# EAGLE design MaTouch DevKit_Relay V1.2 (EAGLE 6.1)
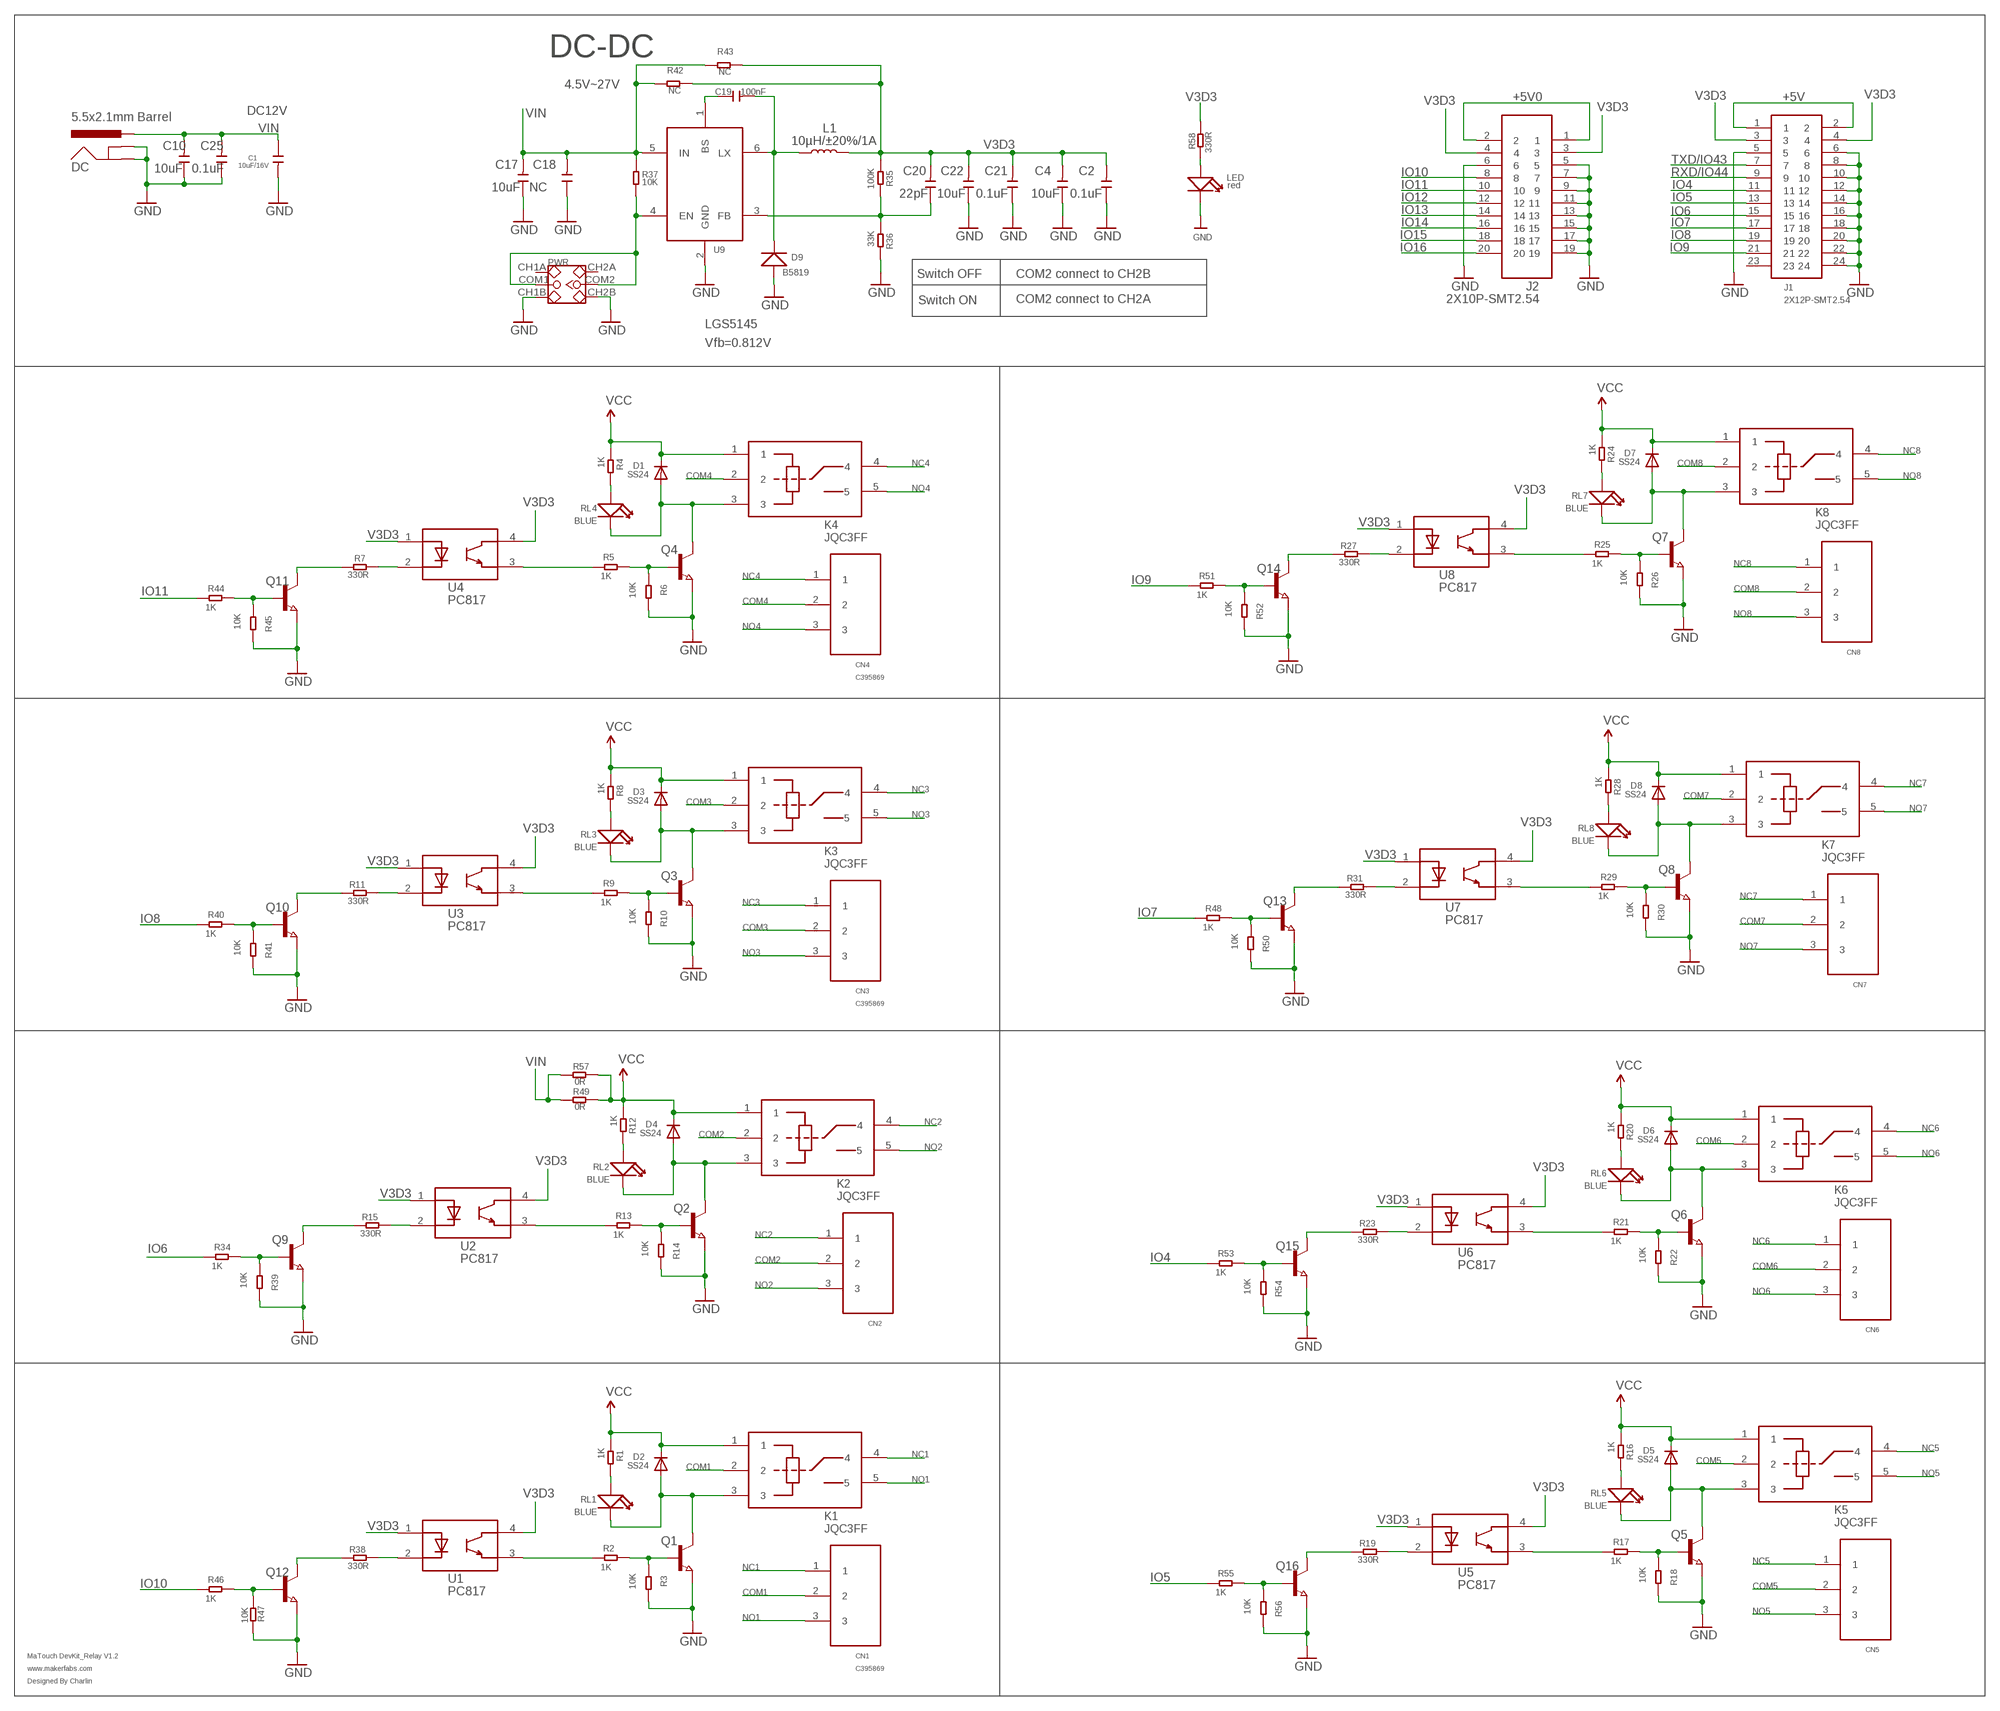
[diagram p0: schematic, sheet 1]

## Parts
C1  10uF/16V  C-0603  [0603]
C2  0.1uF  C-0603  [0603]
C4  10uF  C-0603  [0603]
C10  10uF  C-0603  [0603]
C17  10uF  C-0603  [0603]
C18  NC  C-0603  [0603]
C19  100nF  C-0603  [0603]
C20  22pF  C-0603  [0603]
C21  0.1uF  C-0603  [0603]
C22  10uF  C-0603  [0603]
C25  0.1uF  C-0603  [0603]
CN1  C395869  [PIN_3P]
CN2  C395869  [PIN_3P]
CN3  C395869  [PIN_3P]
CN4  C395869  [PIN_3P]
CN5  C395869  [PIN_3P]
CN6  C395869  [PIN_3P]
CN7  C395869  [PIN_3P]
CN8  C395869  [PIN_3P]
D1  SS24  DIODESMA  [SMADIODE]
D2  SS24  DIODESMA  [SMADIODE]
D3  SS24  DIODESMA  [SMADIODE]
D4  SS24  DIODESMA  [SMADIODE]
D5  SS24  DIODESMA  [SMADIODE]
D6  SS24  DIODESMA  [SMADIODE]
D7  SS24  DIODESMA  [SMADIODE]
D8  SS24  DIODESMA  [SMADIODE]
D9  B5819  D'1206'  [SOD123]
DC  5.5x2.1mm Barrel  POWER_JACKSMD  [POWER_JACK_SMD]
J1  2X12P-SMT2.54  [2X12P-SMT2.54]
J2  2X10P-SMT2.54  [2X10P-SMT2.54]
K1  JQC3FF  [DIP5_JQC3FF]
K2  JQC3FF  [DIP5_JQC3FF]
K3  JQC3FF  [DIP5_JQC3FF]
K4  JQC3FF  [DIP5_JQC3FF]
K5  JQC3FF  [DIP5_JQC3FF]
K6  JQC3FF  [DIP5_JQC3FF]
K7  JQC3FF  [DIP5_JQC3FF]
K8  JQC3FF  [DIP5_JQC3FF]
L1  10µH/±20%/1A  INDUCTOR-SRN6045-33UH  [SRN6045]
LED  red  DISCRETE_LED0603  [DISCRETE_LED-0603]
PWR  SWITCH-2CH-6P  [6P-2CH-2.54-7.6X3.0]
Q1  NPN-TRANSISTOR_SOT23  [SOT23]
Q2  NPN-TRANSISTOR_SOT23  [SOT23]
Q3  NPN-TRANSISTOR_SOT23  [SOT23]
Q4  NPN-TRANSISTOR_SOT23  [SOT23]
Q5  NPN-TRANSISTOR_SOT23  [SOT23]
Q6  NPN-TRANSISTOR_SOT23  [SOT23]
Q7  NPN-TRANSISTOR_SOT23  [SOT23]
Q8  NPN-TRANSISTOR_SOT23  [SOT23]
Q9  NPN-TRANSISTOR_SOT23  [SOT23]
Q10  NPN-TRANSISTOR_SOT23  [SOT23]
Q11  NPN-TRANSISTOR_SOT23  [SOT23]
Q12  NPN-TRANSISTOR_SOT23  [SOT23]
Q13  NPN-TRANSISTOR_SOT23  [SOT23]
Q14  NPN-TRANSISTOR_SOT23  [SOT23]
Q15  NPN-TRANSISTOR_SOT23  [SOT23]
Q16  NPN-TRANSISTOR_SOT23  [SOT23]
R1  1K  R-0603  [R0603]
R2  1K  R-0603  [R0603]
R3  10K  R-0603  [R0603]
R4  1K  R-0603  [R0603]
R5  1K  R-0603  [R0603]
R6  10K  R-0603  [R0603]
R7  330R  R-0603  [R0603]
R8  1K  R-0603  [R0603]
R9  1K  R-0603  [R0603]
R10  10K  R-0603  [R0603]
R11  330R  R-0603  [R0603]
R12  1K  R-0603  [R0603]
R13  1K  R-0603  [R0603]
R14  10K  R-0603  [R0603]
R15  330R  R-0603  [R0603]
R16  1K  R-0603  [R0603]
R17  1K  R-0603  [R0603]
R18  10K  R-0603  [R0603]
R19  330R  R-0603  [R0603]
R20  1K  R-0603  [R0603]
R21  1K  R-0603  [R0603]
R22  10K  R-0603  [R0603]
R23  330R  R-0603  [R0603]
R24  1K  R-0603  [R0603]
R25  1K  R-0603  [R0603]
R26  10K  R-0603  [R0603]
R27  330R  R-0603  [R0603]
R28  1K  R-0603  [R0603]
R29  1K  R-0603  [R0603]
R30  10K  R-0603  [R0603]
R31  330R  R-0603  [R0603]
R34  1K  R-0603  [R0603]
R35  100K  R-0603  [R0603]
R36  33K  R-0603  [R0603]
R37  10K  R-0603  [R0603]
R38  330R  R-0603  [R0603]
R39  10K  R-0603  [R0603]
R40  1K  R-0603  [R0603]
R41  10K  R-0603  [R0603]
R42  NC  R-0603  [R0603]
R43  NC  R-0603  [R0603]
R44  1K  R-0603  [R0603]
R45  10K  R-0603  [R0603]
R46  1K  R-0603  [R0603]
R47  10K  R-0603  [R0603]
R48  1K  R-0603  [R0603]
R49  0R  R-0603  [R0603]
R50  10K  R-0603  [R0603]
R51  1K  R-0603  [R0603]
R52  10K  R-0603  [R0603]
R53  1K  R-0603  [R0603]
R54  10K  R-0603  [R0603]
R55  1K  R-0603  [R0603]
R56  10K  R-0603  [R0603]
R57  0R  R-0603  [R0603]
R58  330R  R-0603  [R0603]
RL1  BLUE  LED'0603'  [LED-0603]
RL2  BLUE  LED'0603'  [LED-0603]
RL3  BLUE  LED'0603'  [LED-0603]
RL4  BLUE  LED'0603'  [LED-0603]
RL5  BLUE  LED'0603'  [LED-0603]
RL6  BLUE  LED'0603'  [LED-0603]
RL7  BLUE  LED'0603'  [LED-0603]
RL8  BLUE  LED'0603'  [LED-0603]
U1  PC817  [SMD4-254P-1016L460W]
U2  PC817  [SMD4-254P-1016L460W]
U3  PC817  [SMD4-254P-1016L460W]
U4  PC817  [SMD4-254P-1016L460W]
U5  PC817  [SMD4-254P-1016L460W]
U6  PC817  [SMD4-254P-1016L460W]
U7  PC817  [SMD4-254P-1016L460W]
U8  PC817  [SMD4-254P-1016L460W]
U9  SY8201ABC  [SOT-23-6]

## Nets
+5V: J1.1 J1.2
+5V0: J2.1 J2.2
COM1: CN1.2 K1.2
COM2: CN2.2 K2.2
COM3: CN3.2 K3.2
COM4: CN4.2 K4.2
COM5: CN5.2 K5.2
COM6: CN6.2 K6.2
COM7: CN7.2 K7.2
COM8: CN8.2 K8.2
GND: C1.2 C2.1 C4.1 C10.1 C17.1 C18.1 C21.1 C22.1 C25.1 D9.+ DC.GND(GNDBREAK) DC.P$4(GND) J1.5 J1.6 J1.8 J1.10 J1.12 J1.14 J1.16 J1.18 J1.20 J1.22 J1.24 J2.5 J2.6 J2.7 J2.9 J2.11 J2.13 J2.15 J2.17 J2.19 LED.- PWR.CH1B PWR.CH2B Q1.2(E) Q2.2(E) Q3.2(E) Q4.2(E) Q5.2(E) Q6.2(E) Q7.2(E) Q8.2(E) Q9.2(E) Q10.2(E) Q11.2(E) Q12.2(E) Q13.2(E) Q14.2(E) Q15.2(E) Q16.2(E) R3.2 R6.2 R10.2 R14.2 R18.2 R22.2 R26.2 R30.2 R36.2 R39.2 R41.2 R45.2 R47.2 R50.2 R52.2 R54.2 R56.2 U9.2(GND)
IO4: J1.11 R53.1
IO5: J1.13 R55.1
IO6: J1.15 R34.1
IO7: J1.17 R48.1
IO8: J1.19 R40.1
IO9: J1.21 R51.1
IO10: J2.8 R46.1
IO11: J2.10 R44.1
IO12: J2.12
IO13: J2.14
IO14: J2.16
IO15: J2.18
IO16: J2.20
N$1: R2.1 U1.3
N$2: R4.2 RL4.+
N$3: R1.2 RL1.+
N$4: D1.A K4.3 Q4.3(C) RL4.-
N$5: Q4.1(B) R5.2 R6.1
N$6: R7.2 U4.2
N$7: R5.1 U4.3
N$8: R8.2 RL3.+
N$9: D2.A K1.3 Q1.3(C) RL1.-
N$10: D3.A K3.3 Q3.3(C) RL3.-
N$11: Q3.1(B) R9.2 R10.1
N$12: R11.2 U3.2
N$13: R9.1 U3.3
N$14: Q1.1(B) R2.2 R3.1
N$15: R12.2 RL2.+
N$16: D4.A K2.3 Q2.3(C) RL2.-
N$17: Q2.1(B) R13.2 R14.1
N$18: R15.2 U2.2
N$19: R13.1 U2.3
N$20: R16.2 RL5.+
N$21: D5.A K5.3 Q5.3(C) RL5.-
N$22: Q5.1(B) R17.2 R18.1
N$23: R19.2 U5.2
N$24: R17.1 U5.3
N$25: R20.2 RL6.+
N$26: D6.A K6.3 Q6.3(C) RL6.-
N$27: Q6.1(B) R21.2 R22.1
N$28: R23.2 U6.2
N$29: R21.1 U6.3
N$30: R24.2 RL7.+
N$31: D7.A K8.3 Q7.3(C) RL7.-
N$32: Q7.1(B) R25.2 R26.1
N$33: R38.2 U1.2
N$34: R27.2 U8.2
N$35: R25.1 U8.3
N$36: R28.2 RL8.+
N$37: D8.A K7.3 Q8.3(C) RL8.-
N$38: Q8.1(B) R29.2 R30.1
N$39: R31.2 U7.2
N$40: R29.1 U7.3
N$41: C19.2 D9.- L1.1 U9.6(LX)
N$42: C19.1 U9.1(BS)
N$43: C20.1 R35.2 R36.1 U9.3(FB)
N$44: PWR.COM1 PWR.COM2 R37.2 U9.4(EN)
N$45: LED.+ R58.1
N$46: Q9.1(B) R34.2 R39.1
N$47: Q9.3(C) R15.1
N$48: Q10.1(B) R40.2 R41.1
N$49: Q10.3(C) R11.1
N$50: Q11.1(B) R44.2 R45.1
N$51: Q11.3(C) R7.1
N$52: Q12.1(B) R46.2 R47.1
N$53: Q12.3(C) R38.1
N$54: Q13.1(B) R48.2 R50.1
N$55: Q13.3(C) R31.1
N$56: Q14.1(B) R51.2 R52.1
N$57: Q14.3(C) R27.1
N$58: Q15.1(B) R53.2 R54.1
N$59: Q15.3(C) R23.1
N$60: Q16.1(B) R55.2 R56.1
N$61: Q16.3(C) R19.1
NC1: CN1.1 K1.4
NC2: CN2.1 K2.4
NC3: CN3.1 K3.4
NC4: CN4.1 K4.4
NC5: CN5.1 K5.4
NC6: CN6.1 K6.4
NC7: CN7.1 K7.4
NC8: CN8.1 K8.4
NO1: CN1.3 K1.5
NO2: CN2.3 K2.5
NO3: CN3.3 K3.5
NO4: CN4.3 K4.5
NO5: CN5.3 K5.5
NO6: CN6.3 K6.5
NO7: CN7.3 K7.5
NO8: CN8.3 K8.5
RXD/IO44: J1.9
TXD/IO43: J1.7
V3D3: C2.2 C4.2 C20.2 C21.2 C22.2 J1.3 J1.4 J2.3 J2.4 L1.2 R35.1 R42.2 R43.2 R58.2 U1.1 U1.4 U2.1 U2.4 U3.1 U3.4 U4.1 U4.4 U5.1 U5.4 U6.1 U6.4 U7.1 U7.4 U8.1 U8.4
VCC: D1.C D2.C D3.C D4.C D5.C D6.C D7.C D8.C K1.1 K2.1 K3.1 K4.1 K5.1 K6.1 K7.1 K8.1 R1.1 R4.1 R8.1 R12.1 R16.1 R20.1 R24.1 R28.1 R49.2 R57.2
VIN: C1.1 C10.2 C17.2 C18.2 C25.2 DC.VIN0(PWR) R37.1 R42.1 R43.1 R49.1 R57.1 U9.5(IN)
Unconnected: J1.23 PWR.CH1A PWR.CH2A

## Notes on the sheet
- DC-DC
- 4.5V~27V
- DC12V
- Switch OFF | COM2 connect to CH2B
- Switch ON | COM2 connect to CH2A
- LGS5145
- Vfb=0.812V
- MaTouch DevKit_Relay V1.2
- www.makerfabs.com
- Designed By Charlin

## Library data of the parts
C1 C2 C4 C10 C17-C22 C25 = Discrete:C*: Ceramic Capacitors
CN1-CN8 = 1mytest:C395869
D1-D8 = adafruit:DIODE: Diode SMADIODE - SMA Surface Mount Package 20V 1A Schottky Diode Digikey: 641-1014-6-ND DO-1N4148 - Through Hole Small Current Diode SOD-123 20V 1 A (.5mV Vf) Schottky Diode - Digikey: MBRX120TPMSCT-ND SOD-323 10V 570mA (.38mV Vf, 3ns) Schottky Diode - Digikey: ZLLS410CT-ND SOD-523 30V 30mA Schottky Diode (RB751S-40TE61) - Digikey: RB751S-40TE61CT-ND SOT23-R/W - SOT23 Package (R = Solder Paste/Reflow Ovens, W = Hand-Soldering) BAT54Film 40V 300mA - Digikey: 497-7162-1-ND
D9 = Discrete:D*
DC = SparkFun-Connectors:POWER_JACK: Power Jack Connector This is the standard 5.5mm barrel jack for power. The PTH is the most common, proven, reliable, footprint. The Slot footprint only works if the mill layer is transmitted to the PCB fab house so be warned. Here are the connectors we sell at SparkFun: DC Barrel Power Jack/Connector <https://www.sparkfun.com/products/119> (PRT-00119) DC Barrel Power Jack/Connector (SMD) <https://www.sparkfun.com/products/12748> (PRT-12748) DC Barrel Jack Adapter - Breadboard Compatible <https://www.sparkfun.com/products/10811> (PRT-10811) It is used on this SparkFun product (and many, many others): SparkFun RedBoard - Programmed with Arduino <https://www.sparkfun.com/products/12757> (DEV-12757) Also, if you need a mating power supply or connector, please check these out: Wall Adapter Power Supply - 9VDC 650mA <https://www.sparkfun.com/products/298> (TOL-00298) DC Barrel Jack Adapter - Male <https://www.sparkfun.com/products/10287> (PRT-10287); PROD_ID: CONN-08106; SF_ID: PRT-12748
J1 = sale:2X12P-SMT2.54
J2 = sale:2X10P-SMT2.54
K1-K8 = 1mytest:JQC3FF
L1 = SparkFun-Coils:INDUCTOR: Inductors Resist changes in electrical current. Basically a coil of wire. SparkFun Products: SparkFun Load Cell Amplifier - HX711 <https://www.sparkfun.com/products/13879> IOIO-OTG - V2.2 <https://www.sparkfun.com/products/13613>; PROD_ID: NDUC-11627; VALUE: 33µH/±20%/1.4A
LED = A9G:DISCRETE_LED*
PWR = Discrete:SWITCH-2CH-6P
Q1-Q16 = semicon-smd-ipc:NPN-TRANSISTOR_: NPN TRANSISTOR
R1-R31 R34-R58 = Discrete:R*
RL1-RL8 = Discrete:LED*
U1-U8 = self:PC817
U9 = self:SY8201ABC

## Net classes
0 default: width 0.203 mm, drill 0.305 mm, clearance 0.152 mm

## Board
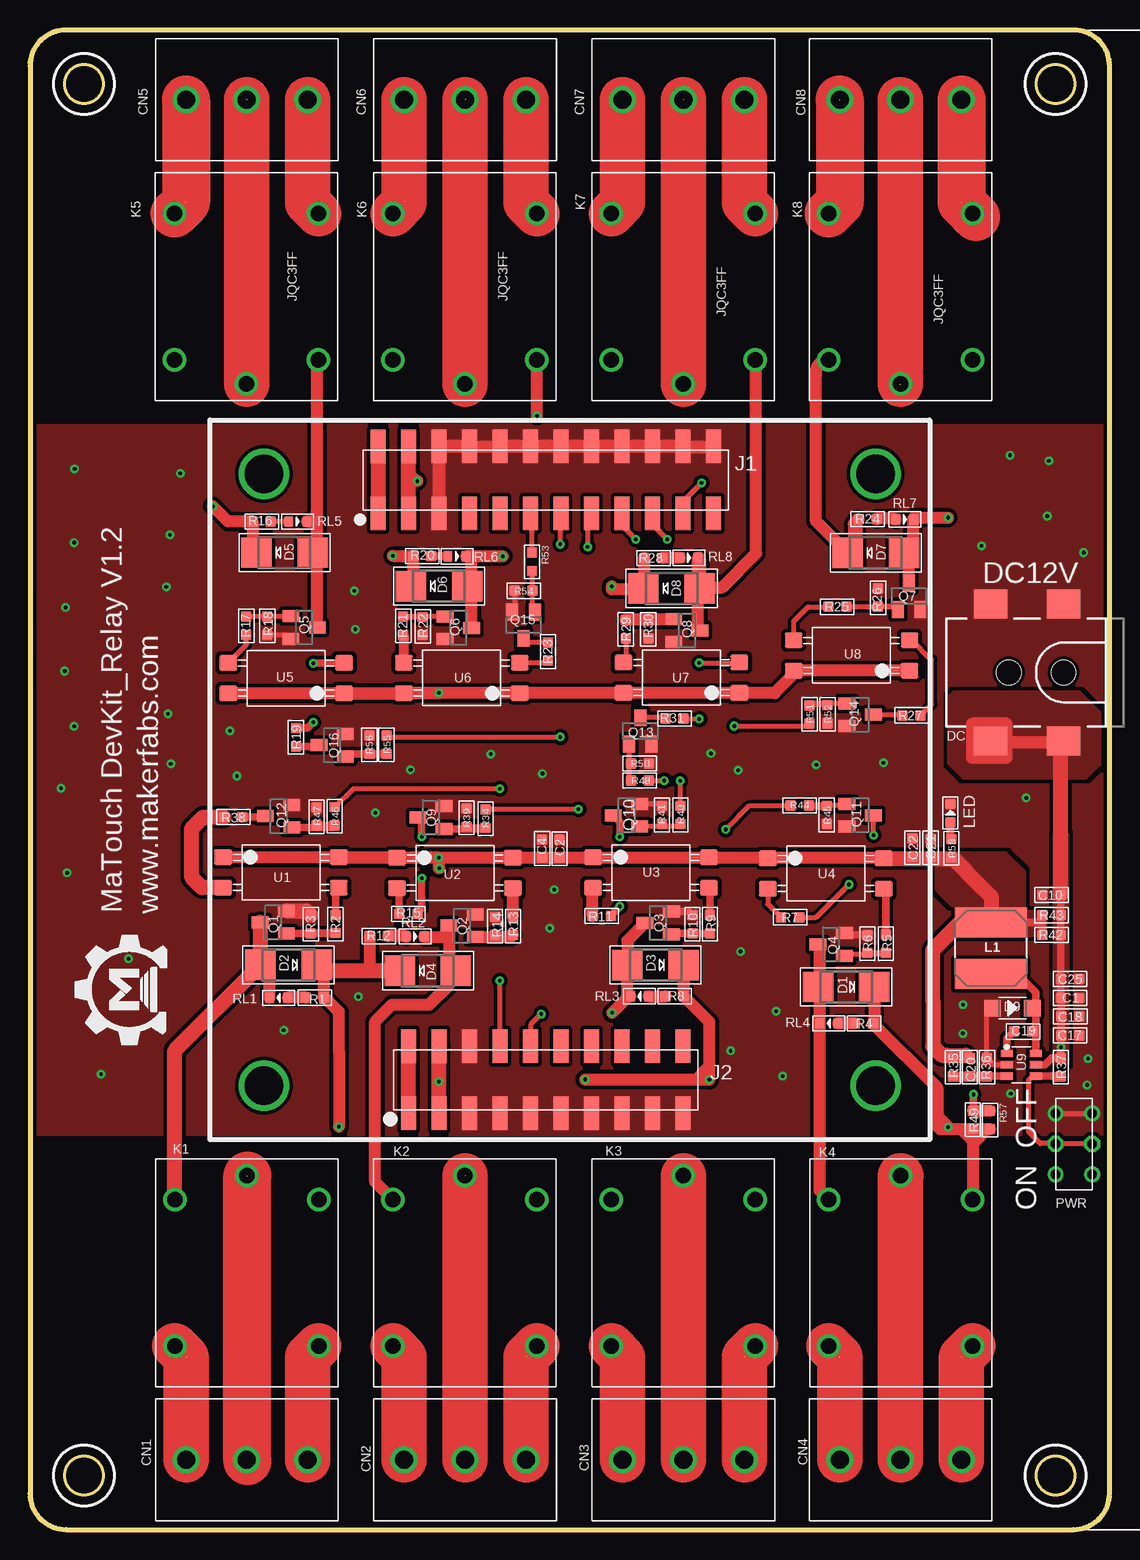
[diagram p1: board, top side]
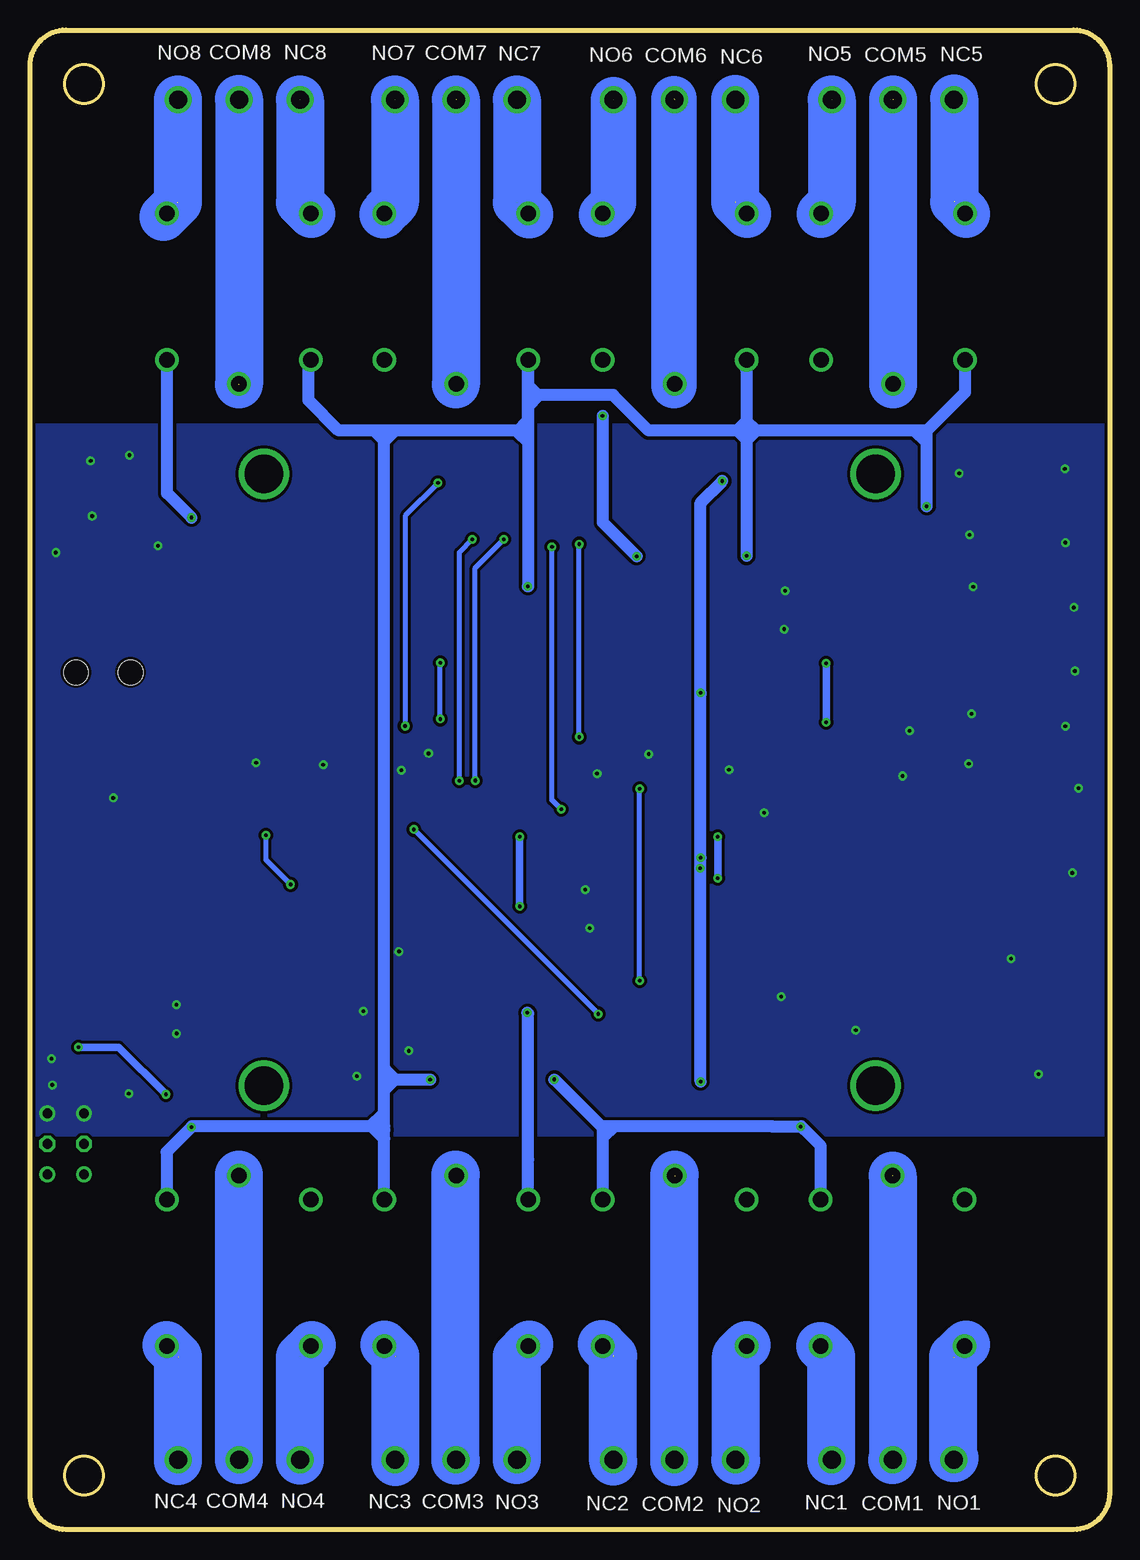
[diagram p2: board, bottom side, seen from below]

Size 90 x 125 mm. Coordinates in mm from the lower left corner, seen from the top.
Outline: 87,125 3,125 arc90 0,122 0,3 arc90 3,0 87,0 arc90 90,3 90,122 arc90 87,125
Outline: circle at 85.5,120.5 radius 1.6
Outline: circle at 85.5,4.5 radius 1.6
Outline: circle at 4.5,4.5 radius 1.6
Outline: circle at 4.5,120.5 radius 1.6
Copper layers (1*16): Top 0.035mm / dielectric 1.5mm / Bottom 0.035mm
Design rules: minimum track width 10mil, minimum drill 10mil, track to track 8mil, track to pad 8mil, pad to pad 8mil, via to via 8mil, smd to smd 0mil, copper to edge 10mil, drill to drill 8mil, minimum pad ring 10mil, minimum via ring 8mil, stop-mask expansion 4mil, vias tented up to drill 30mil, thermal gap 0mil

### Footprints (pad centres in the part's own frame; a part is rotated, then mirrored left to right if it is on the bottom)
0603 = smd 0.889 x 0.889: 1 -0.762,0; 2 0.762,0
PIN_3P = drill 1.5: 1 0,10.16; 2 0,5.08; 3 0,0
SMADIODE = smd 2.54 x 2.54: A 2.349,0; C -2.349,0
SOD123 = smd 1.397 x 1.397: + -1.651,0; - 1.651,0
POWER_JACK_SMD = smd 2.8 x 2.4: GND 0,-5.7; P$4 6.1,-5.7; VIN0 0,5.7; VIN1 6.1,5.7 | hole 2.032: 0,0; 4.572,0
2X12P-SMT2.54 = smd 1.27 x 2.8: 1 -13.97,-2.8; 2 -13.97,2.8; 3 -11.43,-2.8; 4 -11.43,2.8; 5 -8.89,-2.8; 6 -8.89,2.8; 7 -6.35,-2.8; 8 -6.35,2.8; 9 -3.81,-2.8; 10 -3.81,2.8; 11 -1.27,-2.8; 12 -1.27,2.8; 13 1.27,-2.8; 14 1.27,2.8; 15 3.81,-2.8; 16 3.81,2.8; 17 6.35,-2.8; 18 6.35,2.8; 19 8.89,-2.8; 20 8.89,2.8; 21 11.43,-2.8; 22 11.43,2.8; 23 13.97,-2.8; 24 13.97,2.8
2X10P-SMT2.54 = smd 1.27 x 2.8: 1 -11.43,-2.8; 2 -11.43,2.8; 3 -8.89,-2.8; 4 -8.89,2.8; 5 -6.35,-2.8; 6 -6.35,2.8; 7 -3.81,-2.8; 8 -3.81,2.8; 9 -1.27,-2.8; 10 -1.27,2.8; 11 1.27,-2.8; 12 1.27,2.8; 13 3.81,-2.8; 14 3.81,2.8; 15 6.35,-2.8; 16 6.35,2.8; 17 8.89,-2.8; 18 8.89,2.8; 19 11.43,-2.8; 20 11.43,2.8
DIP5_JQC3FF = drill 1.3: 1 0,12; 2 -2,6; 3 0,0; 4 12.2,12; 5 12.2,0
SRN6045 = smd 2.5 x 6: 1 -2.175,0; 2 2.125,0
DISCRETE_LED-0603 = smd 0.889 x 0.889: + -0.762,0; - 0.762,0
6P-2CH-2.54-7.6X3.0 = drill 0.813 pad 1.27: CH1A -1.524,2.54; CH1B -1.524,-2.54; CH2A 1.524,2.54; CH2B 1.524,-2.54 | drill 0.813 pad 1.27 octagon: COM1 -1.524,0; COM2 1.524,0
SOT23 = smd 1 x 1.4: 1 -0.95,-1.1; 2 0.95,-1.1; 3 0,1.1
R0603 = smd 0.889 x 0.889: 1 -0.762,0; 2 0.762,0
LED-0603 = smd 0.762 x 0.889: + -0.762,0; - 0.762,0
SMD4-254P-1016L460W = smd 1.5 x 1.3: 1 -4.83,1.27; 2 -4.83,-1.27; 3 4.83,-1.27; 4 4.83,1.27
SOT-23-6 = smd 1 x 0.6: 1 -1.2,0.95; 2 -1.2,0; 3 -1.2,-0.95; 4 1.2,-0.95; 5 1.2,0; 6 1.2,0.95

### Placement (x,y rotation side)
C1  86.72,44.32 0 top
C2  44.15,56.77 270 top
C4  42.7,56.77 270 top
C10  85.17,52.89 0 top
C17  86.72,41.19 180 top
C18  86.73,42.77 180 top
C19  82.79,41.51 0 top
C20  78.35,38.54 90 top
C21  75.09,56.82 270 top
C22  73.57,56.83 270 top
C25  86.72,45.89 180 top
CN1  13,5.8 270 top
CN2  31.2,5.8 270 top
CN3  49.4,5.8 270 top
CN4  67.5,5.8 270 top
CN5  23.16,119.2 90 top
CN6  41.36,119.2 90 top
CN7  59.56,119.2 90 top
CN8  77.66,119.2 90 top
D1  68.04,45.23 180 top
D2  21.56,47.07 180 top
D3  52.16,47.06 180 top
D4  33.17,46.58 0 top
D5  21.22,81.44 0 top
D6  34.1,78.64 0 top
D7  70.51,81.42 0 top
D8  53.49,78.45 0 top
D9  81.9,43.46 0 top
DC  86.18,71.44 180 top
J1  43,87.5 0 top
J2  43,37.5 0 top
K1  12.07,27.5 270 top
K2  30.25,27.5 270 top
K3  48.47,27.5 270 top
K4  66.6,27.5 270 top
K5  24.05,97.5 90 top
K6  42.25,97.5 90 top
K7  60.47,97.5 90 top
K8  78.57,97.5 90 top
L1  80.11,48.49 90 top
LED  76.73,59.72 90 top
PWR  87.03,32.14 180 top
Q1  20.28,50.62 90 top
Q2  36.02,50.33 90 top
Q3  52.37,50.55 90 top
Q4  66.79,48.78 90 top
Q5  22.86,75.2 270 top
Q6  35.71,75.16 270 top
Q7  73.29,77.8 0 top
Q8  54.76,74.93 270 top
Q9  33.43,59.36 90 top
Q10  49.73,59.54 90 top
Q11  69.22,59.54 270 top
Q12  20.73,59.46 90 top
Q13  50.88,66.57 0 top
Q14  69.22,67.92 270 top
Q15  41.15,75.39 180 top
Q16  25.2,65.38 90 top
R1  23.75,44.34 180 top
R2  25.46,50.47 270 top
R3  23.41,50.46 90 top
R4  69.53,42.19 180 top
R5  71.34,48.84 270 top
R6  69.8,48.82 90 top
R7  63.39,51.03 180 top
R8  53.75,44.45 180 top
R9  56.69,50.45 270 top
R10  55.23,50.45 90 top
R11  47.68,51.14 180 top
R12  29.09,49.46 0 top
R13  40.26,50.31 270 top
R14  38.78,50.31 90 top
R15  31.54,51.3 180 top
R16  19.32,84.02 0 top
R17  18.04,75.34 90 top
R18  19.79,75.34 270 top
R19  22.17,66.04 90 top
R20  32.69,81.15 0 top
R21  31.12,75.33 90 top
R22  32.75,75.31 270 top
R23  43.19,73.19 270 top
R24  69.85,84.23 0 top
R25  67.31,76.92 0 top
R26  70.7,77.68 90 top
R27  73.48,67.87 0 top
R28  51.98,80.98 0 top
R29  49.67,75.04 90 top
R30  51.55,75.04 270 top
R31  53.73,67.6 0 top
R34  37.97,59.26 270 top
R35  76.93,38.53 270 top
R36  79.79,38.55 90 top
R37  85.95,38.55 270 top
R38  16.94,59.39 180 top
R39  36.4,59.33 90 top
R40  54.23,59.56 270 top
R41  52.68,59.56 90 top
R42  85.17,49.56 180 top
R43  85.17,51.21 180 top
R44  64.16,60.35 0 top
R45  66.42,59.56 270 top
R46  25.4,59.46 270 top
R47  23.9,59.44 90 top
R48  50.85,62.43 180 top
R49  78.6,34.15 270 top
R50  50.85,63.86 0 top
R51  65,67.94 90 top
R52  66.5,67.97 270 top
R53  41.86,80.67 270 top
R54  41.15,78.26 180 top
R55  29.72,65.41 270 top
R56  28.3,65.41 90 top
R57  80.04,34.14 270 top
R58  76.81,56.79 270 top
RL1  20.73,44.32 180 top
RL2  32.1,49.44 0 top
RL3  50.81,44.45 180 top
RL4  66.6,42.19 180 top
RL5  22.32,84.03 0 top
RL6  35.59,81.13 0 top
RL7  72.94,84.2 0 top
RL8  54.94,81 0 top
U1  20.92,54.78 0 top
U2  35.43,54.73 0 top
U3  51.77,54.76 0 top
U4  66.34,54.68 0 top
U5  21.36,70.97 180 top
U6  36,70.99 180 top
U7  54.31,71.02 180 top
U8  68.5,72.87 180 top
U9  82.64,38.75 0 top
U$2  [MAKERFABS_0.3]  11.35,40.89 90 top

### Tracks (layer width: path | path; a pad name or v marks a point on that pad's centre or on a via)
+5V
  Top 1.27: J1.2 J1.1
+5V0
  Top 1.27: J2.1 J2.2 31.57,40.59
COM1  (1 unrouted)
  Top 4: 18.11,5.71 18.11,29.49
  Bottom 4: K1.2 18.07,5.83 18.11,5.79 18.1,5.8 CN1.2
COM2  (1 unrouted)
  Top 3.81: CN2.2 36.28,29.47 K2.2
  Bottom 4: 36.27,5.64 36.27,29.54 36.25,29.57
COM3
  Top 3.81: CN3.2 K3.2
  Bottom 4: 54.51,29.59 54.53,29.57 54.53,5.77 54.51,5.77 CN3.2
COM4
  Top 3.81: CN4.2 72.58,29.48 K4.2
  Bottom 4: 72.59,29.59 72.59,5.84 72.57,5.82 CN4.2
COM5  (1 unrouted)
  Top 3.81: CN5.2 18.08,95.53 K5.2
  Bottom 4: 18.06,119.23 18.06,95.45
COM6  (1 unrouted)
  Top 3.81: CN6.2 36.28,95.53 K6.2
  Bottom 3.81: 36.3,119.25 36.3,95.35
COM7  (1 unrouted)
  Top 3.81: CN7.2 K7.2
  Bottom 4: 54.48,119.23 54.48,95.45
COM8  (1 unrouted)
  Top 3.81: CN8.2 K8.2
  Bottom 4: 72.57,119.25 72.57,95.45
GND  (via drill 0.3)
  Top 0.406: R54.2 40.39,76.67 Q15.2 40.2,76.57 40.34,76.71 40.34,76.63 | Q5.2 21.43,74.58 R18.2 | R41.2 52.52,60.49 Q10.2 | PWR.CH2B PWR.CH1B | U9.2 80.35,38.75 R36.2 79.79,43 D9.+
  Top 0.61: Q3.2 54.94,51.5 R10.2 | R6.2 67.92,49.58 67.79,49.71 67.82,49.71 67.84,49.73 67.89,49.68
  Top 1.016: J1.6 J1.5 34.11,90.22 34.06,90.27 34.8,90.27 | 34.8,90.27 56.94,90.27 | 56.94,90.27 J1.24 | 56.94,90.27 56.94,90.17 56.95,90.17 54.56,90.17 J1.22 J1.20 J1.18 J1.16 J1.14 J1.12 J1.10 | J1.8 34.83,90.3 34.8,90.27
  Top 1.27: Q1.2 23.06,51.57 R3.2
  other vias: 87.85,81.44 3.69,82.27 2.59,61.79 3.72,88.41 27.13,75.06 79.35,82.01 21.15,41.64 11.5,67.99 2.89,71.56 11.73,63.83 11.66,82.9 2.97,76.86 27.05,78.25 12.52,88.03 65.56,63.75 31.73,63.35 43.33,50.11 3.1,54.73 59.03,63.29 71.15,63.93 84.94,89.08 84.81,84.48 59.23,48.18 62.74,37.79 58.42,39.9 62.21,43.2 17.25,62.81 28.78,59.76 38.41,64.64 27.38,44.42 56.77,64.69 42.72,63.01 5.92,37.97 8.21,47.6 11.36,78.59 81.71,89.56 3.69,66.95 16.66,66.6 43.72,53.34 83.06,60.98 88.14,37.06 88.22,39.24 81.76,36.32 77.8,43.74 77.78,41.35
  pour Bottom (isolate 0.254, rank 4): -1.2,33 -1.2,92 100,92 100,33
  pour Top (isolate 0.305, rank 4, no thermals): -0.6,33 -0.6,92 100,92 100,33
IO4
  Top 0.406: R53.1 41.86,84.53 41.68,84.71 41.68,84.68 41.73,84.68 J1.11
IO5  (via drill 0.3)
  Top 0.406: R55.1 29.72,66.06 v44.22,66.06 | v44.22,82.14 44.22,84.68 | 44.22,84.68 44.22,84.73 44.27,84.73 | J1.13 44.27,84.68 44.22,84.68
  Bottom 0.406: v44.22,66.06 v44.22,82.14
IO6  (via drill 0.3)
  Top 0.406: R34.1 38,60.05 v45.72,60.05 | 46.74,84.7 J1.15 46.48,84.37 v46.48,81.92
  Bottom 0.406: v45.72,60.05 46.48,60.81 v46.48,81.92
IO7  (via drill 0.3)
  Top 0.406: R48.1 v52.88,62.43 | v50.49,82.55 49.35,83.69 J1.17
  Bottom 0.406: v52.88,62.43 52.88,80.16 v50.49,82.55
IO8  (via drill 0.3)
  Top 0.406: v53.11,82.55 51.89,83.77 J1.19 | v54.2,62.41 54.2,61.34 54.2,60.27 54.23,60.3 R40.1
  Bottom 0.406: v54.2,62.41 54.2,81.46 v53.11,82.55
IO9  (via drill 0.3)
  Top 0.406: J1.21 54.43,85.7 v55.98,87.25 | v58.73,66.98 64.82,66.98 arc90 65.02,67.18 R51.1
  Bottom 0.406: v55.98,87.25 58.73,84.51 v58.73,66.98
IO10  (via drill 0.3)
  Top 0.406: J2.8 39.19,45.72 v39.17,45.74 | 25.43,60.2 R46.1 25.45,60.22 26.98,61.75 28.93,61.75 v39.17,61.75
  Bottom 0.406: v39.17,45.74 v39.17,61.75
IO11  (via drill 0.3)
  Top 0.406: v42.62,42.98 41.73,42.09 J2.10 | v58,58.36 59.99,60.35 R44.1
  Bottom 0.406: v58,58.36 v42.62,42.98
N$1
  Top 0.305: U1.3 25.71,53.51 25.7,53.52
  Top 0.61: R2.1 25.46,53.27 25.7,53.52
N$2
  Top 1.016: R4.2 RL4.+ arc90 RL4.+
N$3
  Top 1.016: R1.2 21.5,44.34 RL1.+
N$4
  Top 1.016: RL4.- 65.84,48.49 arc90 65.71,48.62 65.71,48.76 arc90 Q4.3 | RL4.- 65.84,45.09 arc90 D1.A | K4.3 65.84,28.26 RL4.- | RL4.- 65.84,42.27 | RL4.-
N$5
  Top 0.406: Q4.1 68.04,47.98 71.42,47.98 71.42,47.95 71.37,48.01 71.27,48.01 | 71.27,48.01 R5.2 | 71.27,48.01 71.27,48.03 71.25,48.05 R6.1
N$6
  Top 0.406: U4.2 61.51,52.13 62.64,51 62.64,51.02 R7.2
N$7
  Top 0.61: R5.1 71.34,53.24 U4.3
N$8
  Top 1.016: RL3.+ R8.2
N$9
  Top 1.016: RL1.- 19.96,46.61 19.79,46.79 19.49,46.79 D2.A
  Top 1.27: K1.3 12.07,39.92 D2.A 19.21,50.59 Q1.3
N$10  (via drill 0.3)
  Top 1.016: v48.54,43.08 49.81,44.35 D3.A | D3.A 49.96,47.22 | RL3.- 49.81,44.7 D3.A | Q3.3 49.81,49.09 D3.A
  Bottom 1.016: K3.3 48.47,30.83 48.46,30.84 48.46,43 v48.54,43.08
N$11
  Top 0.61: Q3.1 53.55,49.69 R9.2 R10.1
N$12
  Top 1.016: R11.2 46.91,53.46 U3.2
N$13
  Top 0.61: R9.1 56.69,53.47 | 56.69,53.47 56.69,53.6 56.67,53.62 56.67,53.59 56.62,53.59 56.57,53.54 | U3.3 56.66,53.49 56.69,53.47
N$14
  Top 0.61: Q1.1 25.34,49.67 | 25.34,49.67 25.4,49.73 | 25.4,49.73 25.44,49.73 R2.2 | 25.34,49.67 25.4,49.73 | 25.4,49.73 23.45,49.73 R3.1
N$15
  Top 1.016: RL2.+ 31.32,49.46 R12.2
N$16
  Top 1.016: Q2.3 34.92,49.38 | 34.92,49.38 34.92,46.51 | 34.92,46.51 34.92,46.04 34.9,46.02 34.97,46.02 D4.A 35.86,46.23 | RL2.- 32.92,49.38 34.92,49.38 | K2.3 28.78,28.97 28.78,42.34 30.2,43.76 33.27,43.76 34.92,45.41 34.92,46.51
N$17
  Top 1.016: Q2.1 38.91,49.38 | 38.91,49.38 40.1,49.38 | 40.1,49.38 R13.2 | 40.1,49.38 40.1,49.43 40.06,49.48 | R14.1 38.78,49.52 38.91,49.38
N$18
  Top 0.61: R15.2 30.78,53.28 U2.2
N$19
  Top 1.016: R13.1 U2.3
N$20
  Top 0.305: 21.39,84.05 21.54,84.05 RL5.+ | RL5.+
  Top 0.406: R16.2 20.11,84.05 21.39,84.05
N$21
  Top 1.016: 23.96,81.53 Q5.3 23.96,81.53 | 23.96,81.53 23.96,97.54 23.98,97.56 23.99,97.56 K5.3 | 23.96,81.53 23.96,83.92 23.85,84.02 RL5.- 23.75,84.03 23.77,84 | D5.A 23.86,81.44 23.96,81.53
N$22
  Top 0.305: R17.2 R18.1
  Top 0.406: Q5.1 21.71,76.1 R17.2
N$23  (via drill 0.3)
  Top 0.61: R19.2 23.14,66.8 v23.62,67.28 | v23.62,72.21 26.16,72.21 U5.2
  Bottom 0.61: v23.62,67.28 v23.62,72.21
N$24
  Top 0.406: U5.3 18.04,73.74 R17.1
N$25
  Top 0.61: R20.2 34.81,81.15 RL6.+
N$26  (via drill 0.3)
  Top 1.016: D6.A 36.81,78.64 Q6.3 36.81,81.13 RL6.- v39.42,81.13 arc-90 v39.42,81.13 | v42.27,92.84 42.27,97.48 K6.3
  Bottom 1.016: v39.42,81.13 42.25,83.96 42.25,92.82 v42.27,92.84
N$27
  Top 0.406: Q6.1 31.18,76.11 31.14,76.07 R22.1 | R22.1 | R22.1 32.75,76.06 32.74,76.05 31.16,76.05 R21.2
N$28
  Top 0.305: R23.2 43.18,72.44
  Top 0.406: U6.2 42.92,72.26 43.1,72.44 43.18,72.44 43.23,72.44 43.28,72.39
N$29
  Top 0.813: U6.3 31.17,74.51 R21.1
N$30
  Top 1.016: RL7.+ 72.13,84.25 70.64,84.25 | 70.64,84.25 70.64,84.28 | R24.2 70.64,84.25
N$31  (via drill 0.3)
  Top 0.305: RL7.- 73.61,84.2
  Top 1.016: v76.53,84.35 73.71,84.35 73.61,84.25 73.61,84.2 73.61,81.66 | 73.61,81.66 73.61,81.31 | 73.61,81.31 73.61,80.82 | D7.A 72.87,81.44 72.87,81.71 72.92,81.66 73.61,81.66 | Q7.3 73.29,81.31 73.61,81.31
  Bottom 1.016: v76.53,84.35 78.57,86.39 K8.3
N$32
  Top 0.406: R25.2 72.12,76.92 | 72.12,76.92 Q7.1 | 72.12,76.92 R26.1
N$33
  Top 1.27: U1.2 14.33,53.51 13.49,54.36 13.49,58.45 14.43,59.38 R38.2
N$34
  Top 0.406: R27.2 75.16,68.78 75.16,72.49 73.51,74.14 U8.2
N$35
  Top 0.406: U8.3 63.67,75.71 64.87,76.91 R25.1
N$36
  Top 1.016: R28.2 arc-90 52.77,81 RL8.+
N$37
  Top 1.016: Q8.3 55.7,75.09 RL8.- | RL8.- arc-90 55.84,80.86 D8.A | RL8.- 55.7,78.54 56.03,78.54 57.71,78.54 60.53,81.36 60.53,97.44 K7.3
N$38
  Top 1.016: Q8.1 arc-90 53.65,75.87 50.34,75.87 | 50.34,75.87 49.73,75.87 | 49.73,75.87 49.71,75.87 | 49.71,75.87 arc90 49.67,75.83 R29.2 | 49.71,75.87 49.73,75.87 | R30.1 arc90 51.47,75.87 50.34,75.87
N$39  (via drill 0.3)
  Top 0.406: R31.2 55.82,67.55 v55.8,67.56 | v55.8,72.24 59.08,72.24 U7.2
  Bottom 0.406: v55.8,67.56 v55.8,72.24
N$40
  Top 0.305: U7.3 49.51,72.29 49.53,72.31
  Top 0.406: R29.1 49.67,72.43 49.63,72.39 49.63,72.36 49.58,72.36 49.53,72.31
N$41
  Top 0.61: U9.6 83.84,41.55 | 83.84,41.55 83.84,43.51 | 83.84,43.51 83.84,44.79 82.32,46.3 L1.1 | D9.- 83.79,43.46 83.84,43.51 | C19.2 83.79,41.51 83.84,41.55
N$42
  Top 0.61: U9.1 81.44,40.92 C19.1
N$43
  Top 0.61: U9.3 79.19,37.8 79.17,37.78
  Top 0.813: R35.2 78.19,37.77 C20.1 79.17,37.78 79.78,37.78 R36.1
N$44
  Top 0.406: U9.4 83.6,37.8 83.26,37.47 83.26,33.15 84.23,32.18 85.46,32.18 PWR.COM2 PWR.COM1
  Top 0.61: U9.4 85.29,37.8 | 85.29,37.8 85.94,37.8 R37.2 | 85.48,37.61 85.29,37.8
N$45
  Top 0.61: R58.1 76.73,57.63 LED.+
N$46
  Top 0.61: Q9.1 37.89,58.41 | 37.89,58.41 R34.2 | 37.89,58.41 37.89,58.44 37.92,58.47 37.82,58.47 36.5,58.47 R39.1
N$47  (via drill 0.3)
  Top 0.61: R15.1 32.3,51.43 32.66,51.79 v32.66,54.28 | v32.66,57.76 32.66,59.02 Q9.3
  Bottom 0.61: v32.66,54.28 v32.66,57.76
N$48
  Top 0.406: R40.2 54.02,58.59 53.19,58.59 | 53.19,58.59 Q10.1 | R41.1 52.89,58.59 53.19,58.59
N$49  (via drill 0.3)
  Top 0.61: R11.1 48.44,51.21 v49.17,51.94 | v49.17,57.76 49.17,59 Q10.3
  Bottom 0.61: v49.17,51.94 v49.17,57.76
N$50
  Top 0.406: Q11.1 67.98,60.35 R44.2
  Top 0.61: R45.1 65,60.33 64.97,60.3 R44.2
N$51  (via drill 0.3)
  Top 0.406: R7.1 65.54,51.03 v68.28,53.77 | v70.33,57.89 70.31,57.9 Q11.3
  Bottom 0.406: v68.28,53.77 70.33,55.83 v70.33,57.89
N$52
  Top 0.61: Q12.1 25.21,58.51 | 25.21,58.51 R46.2 25.38,58.67 R47.1 | 25.21,58.51 25.29,58.51 25.43,58.65 25.3,58.65 25.27,58.62
N$53
  Top 0.61: R38.1 19.55,59.38 Q12.3
N$54
  Top 0.406: R48.2 49.96,62.56 49.96,64.97 | 49.96,64.97 49.96,65.51 Q13.1 | R50.1 49.96,63.98 49.96,64.97
N$55
  Top 0.406: R31.1 52.9,67.67 Q13.3
N$56
  Top 0.406: Q14.1 65.08,68.87 arc90 64.92,68.71 R51.2 arc-90 65.02,68.73 R52.1
N$57
  Top 0.406: Q14.3 72.8,67.92 72.77,67.92 arc90 R27.1
N$58
  Top 0.406: R53.2 41.86,78.08 | 41.86,78.08 41.86,76.73 | 41.86,76.73 Q15.1 | 41.86,76.73 41.94,76.73 42.04,76.63 | R54.1 41.91,78.13 41.86,78.08
N$59
  Top 0.406: R23.1 41.42,73.95 41.15,74.22 41.2,74.22 41.3,74.32
  Top 0.61: 41.3,74.32 41.18,74.32 Q15.3
N$60
  Top 0.61: R56.1 R55.2 R56.1 | R56.1 26.47,64.64 26.31,64.49 26.31,64.45 Q16.1
N$61
  Top 0.61: R19.1 24,65.28 Q16.3
N$73A  (via drill 3.2)
  other vias: 70.5,37
N$73AA  (via drill 3.2)
  other vias: 19.5,37
N$74A  (via drill 3.2)
  other vias: 70.5,88
N$75A  (via drill 3.2)
  other vias: 19.5,88
NC1
  Top 3.81: CN1.1 23.16,14.39 K1.4
  Bottom 4: 23.19,5.71 23.19,14.38 | 23.19,14.38 24.11,15.29 | 23.19,14.38 23.19,14.42 K1.4
NC2  (1 unrouted)
  Top 3.81: CN2.1 41.36,14.41 K2.4
  Bottom 4: 41.38,5.66 41.38,14.48 42.34,15.44
NC3  (1 unrouted)
  Top 3.81: CN3.1 59.56,14.39 K3.4
  Bottom 4: 59.54,5.64 59.54,14.48 60.48,15.42
NC4  (1 unrouted)
  Top 3.81: CN4.1 77.66,14.36 K4.4
  Bottom 4: 77.65,5.69 77.65,14.4 78.64,15.39
NC5  (1 unrouted)
  Top 4: CN5.1 13,110.65 K5.4
  Bottom 4: 12.95,119.3 12.95,110.67 11.94,109.65
NC6  (1 unrouted)
  Top 3.81: CN6.1 31.2,110.65 K6.4
  Bottom 4: 31.22,119.25 31.22,110.67 30.23,109.68
NC7  (1 unrouted)
  Top 3.81: CN7.1 49.4,110.63 K7.4
  Bottom 4: 49.4,119.23 49.4,110.64 48.39,109.63
NC8  (1 unrouted)
  Top 4: CN8.1 67.5,110.63 K8.4
  Bottom 4: 67.49,119.2 67.49,110.62 66.55,109.68
NO1  (1 unrouted)
  Top 3.81: CN1.3 13,14.37 K1.5
  Bottom 4: 12.9,5.94 13.03,5.94 13.03,14.4 11.96,15.42
NO2
  Top 3.81: CN2.3 31.2,14.35 K2.5
  Bottom 4: 30.25,15.39 31.14,14.5 31.14,5.77 31.17,5.77 CN2.3
NO3
  Top 3.81: CN3.3 49.4,14.37 K3.5
  Bottom 4: 48.39,15.42 49.4,14.4 CN3.3
NO4  (1 unrouted)
  Top 3.81: CN4.3 67.5,14.4 K4.5
  Bottom 4: 67.49,5.74 67.49,14.38 66.5,15.37
NO5  (1 unrouted)
  Top 3.81: CN5.3 23.16,110.59 K5.5
  Bottom 4: CN5.3 23.16,110.59 24.08,109.68
NO6  (1 unrouted)
  Top 3.81: CN6.3 41.36,110.59 K6.5
  Bottom 3.81: CN6.3 41.35,110.62 42.37,109.6
NO7  (1 unrouted)
  Top 3.81: CN7.3 59.56,110.61 K7.5
  Bottom 4: CN7.3 59.56,110.62 60.55,109.63
NO8  (1 unrouted)
  Top 4: CN8.3 77.66,110.63 78.89,109.4 78.87,109.4 78.59,109.68 K8.5
  Bottom 4: 77.67,119.23 77.67,110.62 78.87,109.42
V3D3  (via drill 0.3)
  Top 0.305: U8.4 63.82,71.46 | R58.2 | R58.2
  Top 0.61: R42.2 84.41,50.65 | 84.41,50.65 R43.2 | L1.2 84.38,50.61 84.41,50.65 | C21.2 R58.2 76.86,56.03 79.08,53.81 | 34.13,40.3 34.13,37.38 v34.09,37.34 | 40.38,56 40.41,56.03 U3.1 | 25.81,56.13 25.98,55.96 31.17,55.96 | v34.09,56 v34.08,56.01 | C2.2 44.13,55.98 44.09,55.98 | 44.09,55.98 44.09,56.01 | 44.09,55.98 44.07,56.01 C4.2
  Top 0.813: R35.1 76.5,39.45 76.43,39.52 | C20.2 78.2,39.32 78,39.52
  Top 1.016: U8.1 64.06,71.6 64.01,71.65 63.82,71.46 62.08,69.72 59.18,69.72 59.16,69.75 U7.1 U7.4 49.45,69.72 U6.1 34.09,69.72 | U2.1 16.15,56 arc90 16.13,55.98 16.59,55.98 arc-90 16.61,55.96 16.19,55.96 arc-90 U1.1 | U2.1 30.46,56 arc-90 30.38,56.08 | 30.38,56.08 arc53 30.43,55.98 | 30.43,55.98 arc37 30.5,55.96 30.45,55.96 arc-90 30.43,55.98 | 30.43,55.98 30.4,55.98 25.98,55.98 arc-90 25.83,56.13 25.81,56.13 25.76,56.13 arc90 25.7,56.08 25.7,56.11 25.78,56.11 | U2.1 25.81,56 arc-90 U1.4 | 25.78,56.11 25.83,56.11 25.78,56.11 | U3.4 61.39,56.03 | 61.39,56.03 71.09,56.03 arc-90 U4.4 71.25,55.95 arc-90 71.27,55.93 71.22,55.93 arc90 71.17,55.88 | C22.2 76.62,56.02 76.68,55.96 76.68,55.99 C21.2 | U2.1 30.59,56 30.58,56.01 | 30.58,56.01 U2.1 | 30.38,56.08 30.5,56.08 30.58,56.01 | 26.26,69.77 U5.1 | U5.1 31.14,69.7 U6.4 30.71,69.72 34.09,69.72 | U5.1 U5.4 | 30.58,56.01 31.52,56.01 | 61.34,56.01 44.09,56.01 40.39,56.01 40.38,56 U2.4 | 61.34,56.01 61.39,55.96 U4.1 | 61.34,56.01 61.37,56.01 61.39,56.03 | 30.58,56.01 31.52,56.01 | U2.4 | v32.28,87.4 31.57,87.99 31.57,89.74 J1.4 | U5.1 26.21,69.72 34.09,69.72 | U5.1 26.24,69.75 v34.09,69.75 | 31.52,56.01 31.67,56.01 | 31.67,56.01 U2.4 40.26,55.98 | 40.26,55.98 | 40.26,55.98 U2.4 | v34.11,55.12 34.09,55.12 v34.09,56 31.67,56 31.67,56.01
  Top 1.27: 78,39.52 76.43,39.52 76.02,39.52 75.26,40.28 75.26,44.09 75.26,48.31 77.57,50.62 80.1,50.62 L1.2 80.14,50.64 80.14,52.76 79.08,53.81 76.96,55.93 71.27,55.93 | J2.3 J2.4 34.13,40.3 34.14,40.31 | J1.3 31.57,89.74
  Bottom 1.016: v34.09,37.34 v34.09,56 34.09,69.62 | 34.09,69.62 v34.09,69.75 | v34.09,69.75 34.09,85.47 34.09,85.6 v32.28,87.4 | v34.09,69.75 34.09,69.62
  pour Top: 84.71,51.51 82.78,51.51 82.78,49.5 84.71,49.5
  pour Top: 75.67,56.36 81.28,56.36 82.8,54.84 82.8,50.14 82.27,49.61 79.38,49.61 75.77,53.21 75.67,53.31
VCC  (via drill 0.3)
  Top 0.254: 79.81,33.4 79.83,33.38 R57.2 79.78,33.38 | 76.58,33.55 v76.56,33.53
  Top 1.016: D7.C 68.82,81.42 arc90 68.91,81.51 68.91,84.05 arc-90 R24.1 68.68,83.82 68.68,81.41 68.43,81.66 67.61,81.66 | R28.1 51.22,78.53 arc-90 D8.C 51.28,78.45 51.28,78.38 48.49,78.38 v48.49,78.64 | 67.61,81.66 67.46,81.66 67.61,81.66 | 67.61,81.66 67.77,81.81 65.53,84.05 65.53,96.22 65.53,96.46 arc-90 K8.1 | D5.C 18.56,81.75 R16.1 16.51,84.02 v15.24,85.29 | v30.25,81.15 R20.1 31.93,78.82 D6.C | D1.C 70.39,42.3 arc-90 R4.1 75.64,36.84 75.64,33.6 75.86,33.39 79.1,33.39 | 79.1,33.39 R49.2 K4.1 | 79.1,33.39 80.02,33.39 R57.2 | 54.46,46.97 54.48,46.97 54.48,47.04 D3.C R8.1 56.64,42.32 56.64,38.63 | v46.28,37.52 56.62,37.52 v56.64,37.49 56.64,38.63 | 24.11,46.58 24.51,46.18 R1.1 24.56,44.35 25.76,43.16 25.76,39.85 v25.76,33.58 | 31.28,46.12 D4.C | 23.9,46.79 23.9,47.05 D2.C | R12.1 28.33,46.58 28.25,46.58 | 56.64,38.63 55.55,37.54 | 76.58,33.55 75.69,34.44 75.67,34.44 | 78.59,32.41 77.62,33.38 79.78,33.38 78.61,32.21
  Top 1.27: D4.C 28.25,46.58 24.11,46.58 23.9,46.79
  Bottom 0.254: v76.56,33.53 76.48,33.6
  Bottom 0.61: 29.29,91.69 30.25,92.66 31.27,91.64 31.29,91.64 30.23,90.58 29.26,91.54 29.26,91.57 | 48.39,95.56 48.32,95.49 | 48.32,95.49 47.35,94.51 48.41,93.45 | 48.34,94.56 48.32,94.56 48.32,95.49 | 48.39,90.3 48.41,90.3 49.66,91.54 48.46,92.73 48.47,92.73 48.47,93.27 | 61.57,91.59 60.45,90.47 59.41,91.52 60.07,91.52 60.07,91.62 | 41,33.68 41,33.66 42.27,32.38 42.24,32.38 42.24,33.6 | 42.25,33.6 42.24,33.6 | 42.24,33.6 42.22,33.6 42.22,33.63 42.19,33.63 42.19,33.6 42.24,33.6
  Bottom 1.016: K5.1 12.05,94.78 15.21,91.62 | 15.21,91.62 25.32,91.62 30.25,91.62 | 30.25,97.56 30.25,96.55 30.25,92.66 30.25,91.62 | 60.35,91.62 60.07,91.62 48.79,91.62 48.47,91.94 | 60.35,91.62 64.26,91.62 66.78,94.13 66.78,97.31 66.47,97.61 66.47,97.6 K8.1 | 30.25,91.62 30.25,91.64 30.23,91.67 30.23,97.48 K6.1 | v15.24,85.29 15.24,91.24 | 15.24,91.24 15.24,91.59 15.21,91.62 | 30.25,91.62 v30.25,81.15 | K7.1 48.47,94.44 | 48.47,94.44 48.47,93.27 | 48.47,93.27 48.47,91.94 | 48.47,91.94 48.47,78.64 v48.49,78.64 | 48.47,91.94 48.47,93.27 | 48.47,93.27 48.47,94.44 | 48.47,94.44 K7.1 48.46,97.43 48.49,97.43 | 30.25,91.62 38.43,91.62 41.38,94.56 48.34,94.56 48.47,94.44 | K1.1 24.07,29.53 24.07,31.97 25.49,33.39 | 28.17,33.6 28.14,33.6 25.7,33.6 | 28.17,33.6 42.24,33.6 42.25,33.6 | 42.25,33.6 42.37,33.6 | 78.61,27.46 78.61,31.47 v76.56,33.53 76.48,33.6 60.55,33.6 60.47,33.6 60.47,33.33 | 78.61,27.46 78.61,27.36 | K4.1 78.6,27.47 78.61,27.46 | 60.47,33.27 60.47,33.33 | K2.1 42.25,33.6 | 42.25,33.6 42.37,33.6 | 25.49,33.39 25.7,33.6 | 25.7,33.6 25.49,33.39 | 42.37,33.6 v46.28,37.52 | v25.76,33.58 28.14,33.58 28.17,33.6 | 60.47,33.27 60.47,33.33 | 60.47,33.33 60.47,37.19 | 60.47,37.19 60.47,91.57 60.35,91.57 60.35,91.62 | K3.1 60.47,33.27 | 60.47,33.27 60.47,33.28 60.45,33.3 60.45,33.31 60.47,33.33 | 16.26,91.57 16.23,91.57 15.29,90.63 15.29,91.19 15.24,91.24 | v56.64,37.49 60.47,37.49 60.47,37.19 | 60.43,38.41 59.56,37.54 59.56,37.52 60.45,36.63 | 60.45,36.63 60.45,36.6 | 60.45,36.63 60.45,37.19 60.47,37.19 | 60.6,34.57 61.54,33.63 60.88,32.97 | 60.88,32.97 60.48,32.56 | 60.47,33.27 60.88,33.27 60.88,32.97
VIN  (via drill 0.3)
  Top 0.61: U9.5 84.62,38.75 85.19,39.32 R37.1 v85.95,40.21 | v85.95,40.21 85.95,41.18 C17.2 | C17.2 C18.2 C1.1 C25.2 85.95,49.54 R42.1 R43.1 C10.2 | v85.95,40.21 v85.96,40.22 C17.2 | v78.66,36.27 78.66,35.33 79.1,34.9
  Top 1.016: R57.1 79.1,34.9 78.62,34.9 R49.1 | 78.54,67.18 78.54,64.34 81.43,64.34 81.43,65.61 | 81.43,65.61 81.43,67.18 78.64,67.18 78.56,67.18 | 85.93,65.56 85.89,65.61 81.43,65.61
  Top 1.27: C10.2 85.93,65.56 86.11,65.73 86.11,65.74 DC.VIN0
  Bottom 0.61: v85.95,40.21 82.91,40.21 82.6,40.21 v78.66,36.27
  pour Top: 86.56,38.86 86.56,57.86 85.37,57.86 85.37,38.91 85.37,38.86
  pour Top: 76.56,69.39 76.56,63.88 77.8,62.64 88.06,62.64 89.23,63.8 89.23,68.1 87.5,69.82 76.99,69.82

### Text on the board
tPlace: MaTouch DevKit_Relay V1.2 | www.makerfabs.com
bPlace: NC8 | COM8 | NO8 | NC5 | COM5 | NO5 | NC6 | COM6 | NO6 | NC7 | COM7 | NO7 | NO1 | COM1 | NC1 | COM2 | NC2 | NO3 | COM3 | NC3 | NO4 | COM4 | NC4 | NO2
tNames: DC12V | OFF | ON